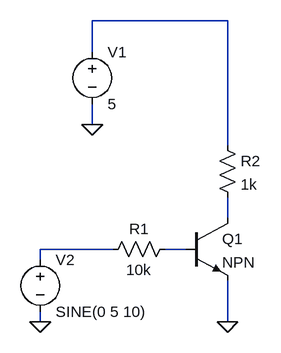
[diagram p0: schematic DC analog to pulse wave.asc]
DC analog to pulse wave.asc, the LTspice schematic file:
Version 4
SHEET 1 880 680
WIRE 144 -128 -64 -128
WIRE -64 -80 -64 -128
WIRE -64 32 -64 0
WIRE 144 64 144 -128
WIRE 144 176 144 144
WIRE -32 224 -144 224
WIRE 80 224 48 224
WIRE -144 240 -144 224
WIRE -144 336 -144 320
WIRE 144 336 144 272
FLAG 144 336 0
FLAG -64 32 0
FLAG -144 336 0
SYMBOL npn 80 176 R0
SYMATTR InstName Q1
SYMBOL res 64 208 R90
WINDOW 0 0 56 VBottom 2
WINDOW 3 32 56 VTop 2
SYMATTR InstName R1
SYMATTR Value 10k
SYMBOL res 128 48 R0
SYMATTR InstName R2
SYMATTR Value 1k
SYMBOL voltage -64 -96 R0
WINDOW 123 0 0 Left 2
WINDOW 39 0 0 Left 2
SYMATTR InstName V1
SYMATTR Value 5
SYMBOL voltage -144 224 R0
WINDOW 123 0 0 Left 2
WINDOW 39 0 0 Left 2
SYMATTR InstName V2
SYMATTR Value SINE(0 5 10)

The netlist it stands for:
* DC analog to pulse wave.asc
Q1 N002 N004 0 0 NPN
R1 N004 N003 10k
R2 N001 N002 1k
V1 N001 0 5
V2 N003 0 SINE(0 5 10)
.model NPN NPN
.model PNP PNP
.lib standard.bjt
.backanno
.end